# EAGLE schematic Spartan2Bone (EAGLE 8.0.1)
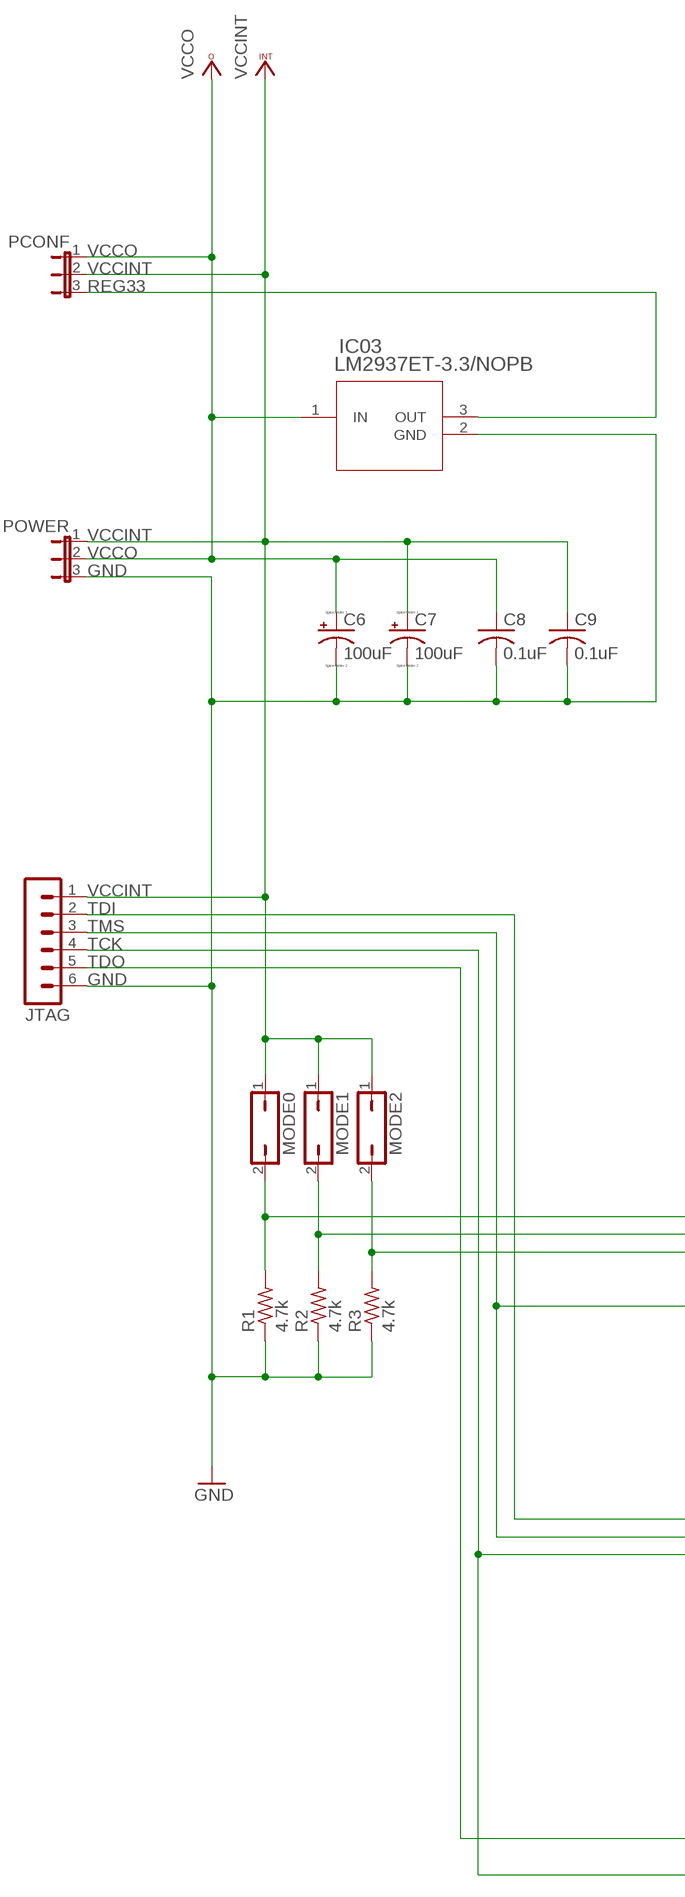
[diagram p0: schematic, sheet 1, part 1 of 2]
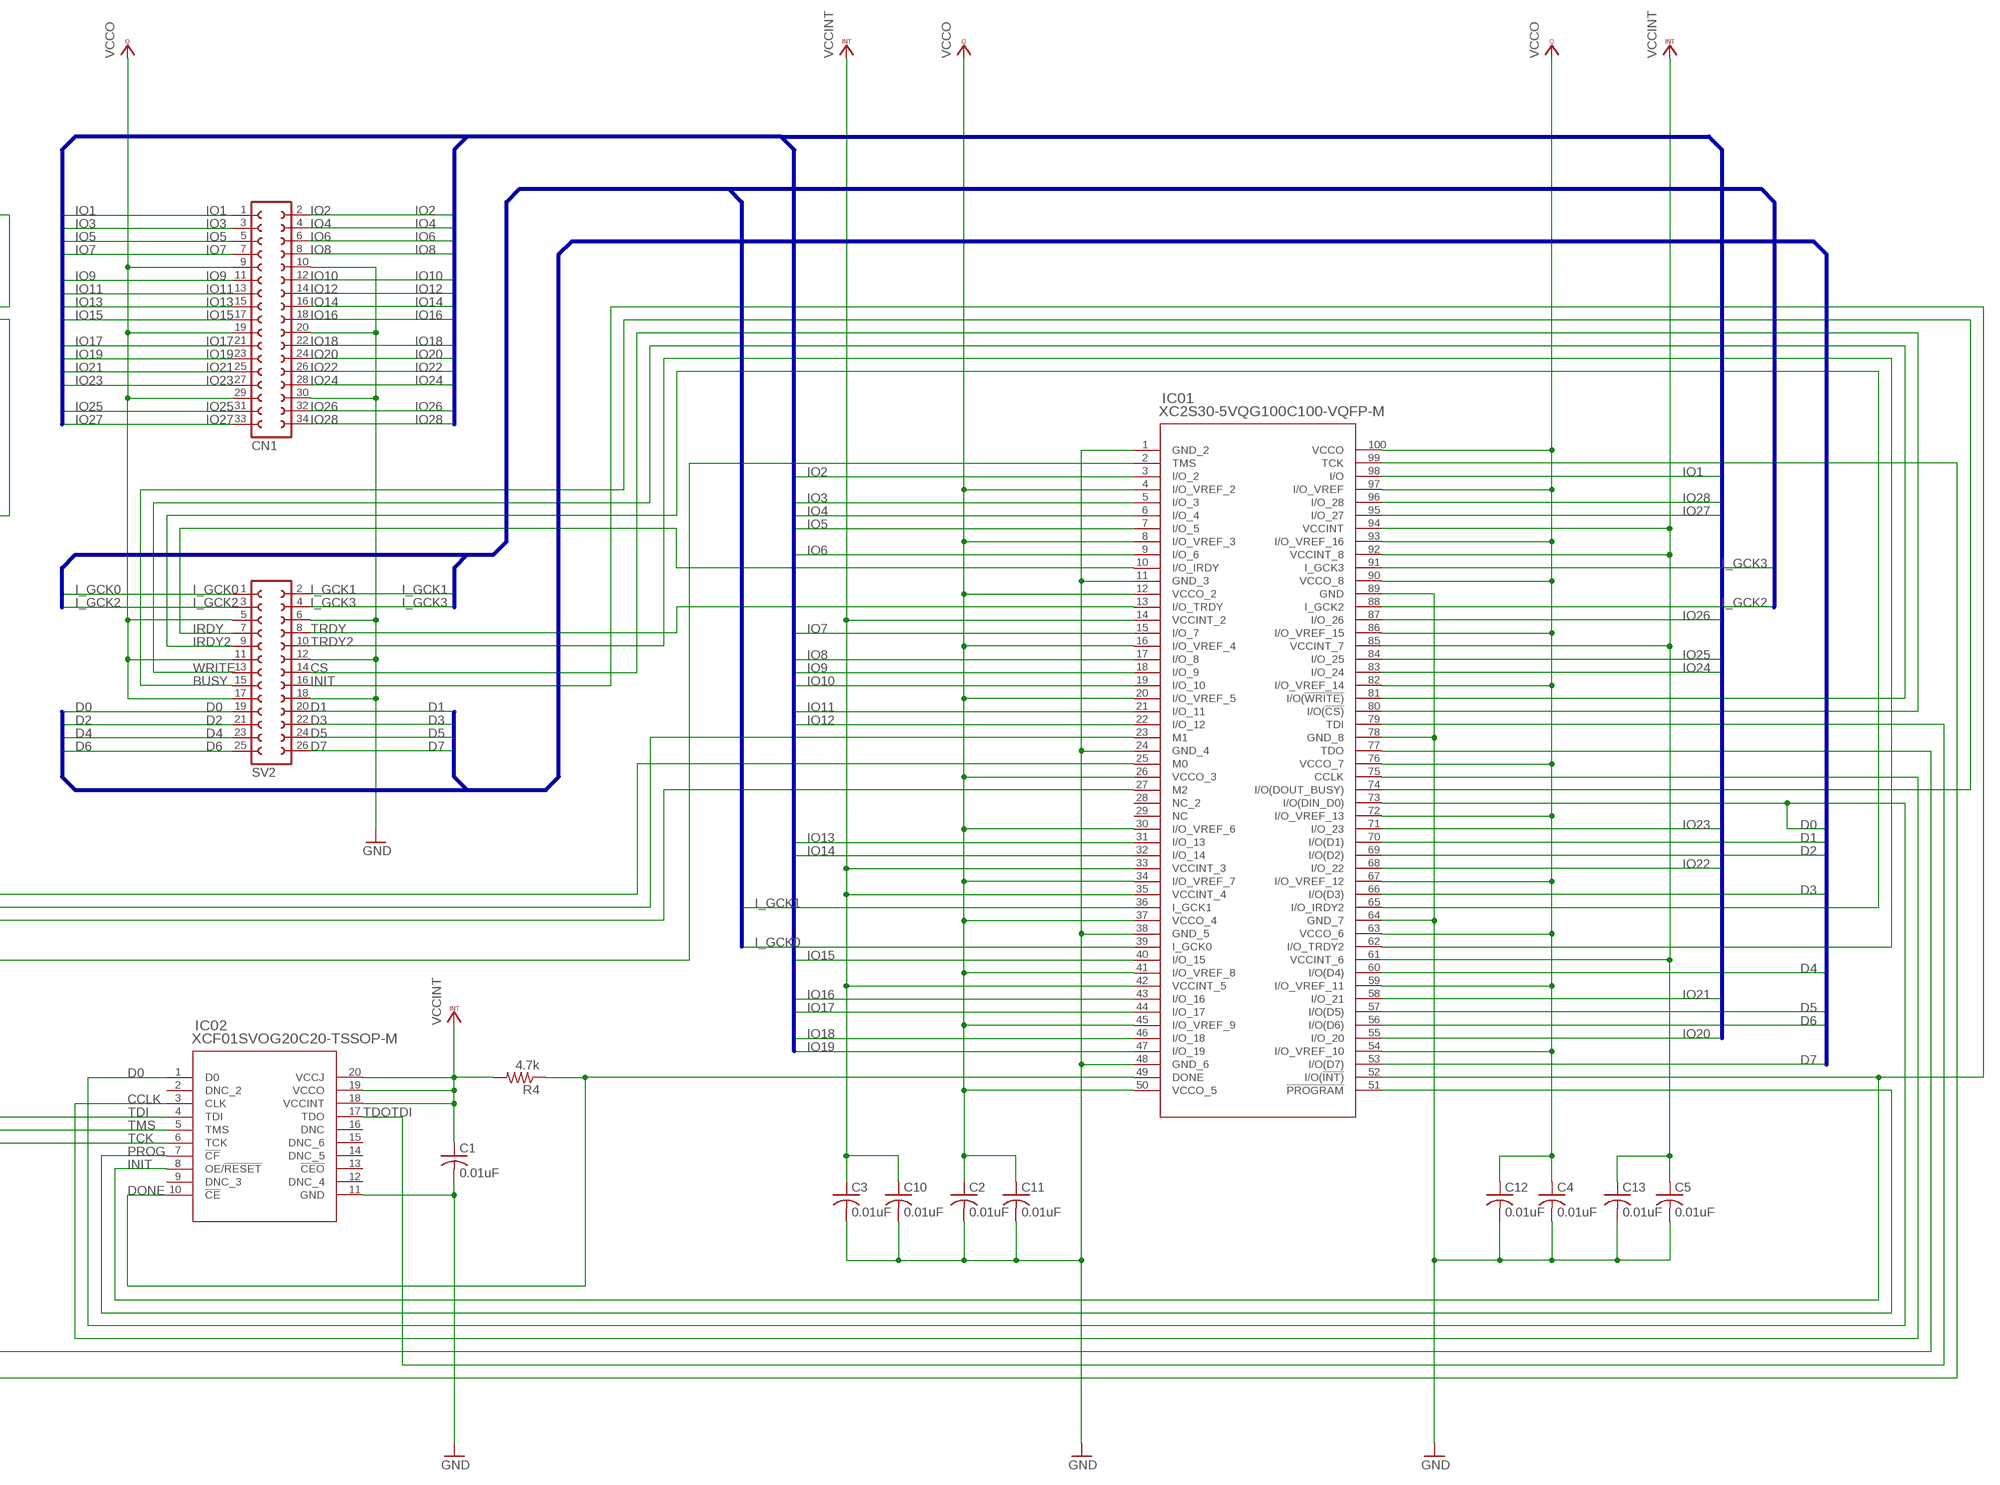
[diagram p1: schematic, sheet 1, part 2 of 2]

## Parts
C1  0.01uF  C-US050-024X044  [C050-024X044]
C2  0.01uF  C-US050-024X044  [C050-024X044]
C3  0.01uF  C-US050-024X044  [C050-024X044]
C4  0.01uF  C-US050-024X044  [C050-024X044]
C5  0.01uF  C-US050-024X044  [C050-024X044]
C6  100uF  CPOL-USE2.5-5  [E2,5-5]
C7  100uF  CPOL-USE2.5-5  [E2,5-5]
C8  0.1uF  C-US050-024X044  [C050-024X044]
C9  0.1uF  C-US050-024X044  [C050-024X044]
C10  0.01uF  C-US050-024X044  [C050-024X044]
C11  0.01uF  C-US050-024X044  [C050-024X044]
C12  0.01uF  C-US050-024X044  [C050-024X044]
C13  0.01uF  C-US050-024X044  [C050-024X044]
CN1  FE17-2  [FE17-2]
IC01  XC2S30-5VQG100C100-VQFP-M  [100-VQFP-M]
IC02  XCF01SVOG20C20-TSSOP-M  [20-TSSOP-M]
IC03  LM2937ET-3.3/NOPB  [T03B]
JTAG  MA06-1  [MA06-1]
MODE0  JP1Q  [JP1]
MODE1  JP1Q  [JP1]
MODE2  JP1Q  [JP1]
PCONF  JP2E  [JP2]
POWER  JP2E  [JP2]
R1  4.7k  R-US_0204/5  [0204/5]
R2  4.7k  R-US_0204/5  [0204/5]
R3  4.7k  R-US_0204/5  [0204/5]
R4  4.7k  R-US_0204/5  [0204/5]
SV2  FE13-2  [FE13-2]

## Nets
BUSY: IC01.74(I/O(DOUT_BUSY)) SV2.15
CCLK: IC01.75(CCLK) IC02.3(CLK)
CS: IC01.80(I/O(!CS)) SV2.14
D0: IC01.73(I/O(DIN_D0)) IC02.1(D0) SV2.19
D1: IC01.70(I/O(D1)) SV2.20
D2: IC01.69(I/O(D2)) SV2.21
D3: IC01.66(I/O(D3)) SV2.22
D4: IC01.60(I/O(D4)) SV2.23
D5: IC01.57(I/O(D5)) SV2.24
D6: IC01.56(I/O(D6)) SV2.25
D7: IC01.53(I/O(D7)) SV2.26
DONE: IC01.49(DONE) IC02.10(!CE) R4.1
GND: C1.2 C2.2 C3.2 C4.2 C5.2 C6.- C7.- C8.2 C9.2 C10.2 C11.2 C12.2 C13.2 CN1.10 CN1.20 CN1.30 IC01.1(GND_2) IC01.11(GND_3) IC01.24(GND_4) IC01.38(GND_5) IC01.48(GND_6) IC01.64(GND_7) IC01.78(GND_8) IC01.89(GND) IC02.11(GND) IC03.2(GND) JTAG.6 POWER.3 R1.1 R2.1 R3.1 SV2.6 SV2.12 SV2.18
I_GCK0: IC01.39(I_GCK0) SV2.1
I_GCK1: IC01.36(I_GCK1) SV2.2
I_GCK2: IC01.88(I_GCK2) SV2.3
I_GCK3: IC01.91(I_GCK3) SV2.4
INIT: IC01.52(I/O(!INT)) IC02.8(OE/!RESET) SV2.16
IO1: CN1.1 IC01.98(I/O)
IO2: CN1.2 IC01.3(I/O_2)
IO3: CN1.3 IC01.5(I/O_3)
IO4: CN1.4 IC01.6(I/O_4)
IO5: CN1.5 IC01.7(I/O_5)
IO6: CN1.6 IC01.9(I/O_6)
IO7: CN1.7 IC01.15(I/O_7)
IO8: CN1.8 IC01.17(I/O_8)
IO9: CN1.11 IC01.18(I/O_9)
IO10: CN1.12 IC01.19(I/O_10)
IO11: CN1.13 IC01.21(I/O_11)
IO12: CN1.14 IC01.22(I/O_12)
IO13: CN1.15 IC01.31(I/O_13)
IO14: CN1.16 IC01.32(I/O_14)
IO15: CN1.17 IC01.40(I/O_15)
IO16: CN1.18 IC01.43(I/O_16)
IO17: CN1.21 IC01.44(I/O_17)
IO18: CN1.22 IC01.46(I/O_18)
IO19: CN1.23 IC01.47(I/O_19)
IO20: CN1.24 IC01.55(I/O_20)
IO21: CN1.25 IC01.58(I/O_21)
IO22: CN1.26 IC01.68(I/O_22)
IO23: CN1.27 IC01.71(I/O_23)
IO24: CN1.28 IC01.83(I/O_24)
IO25: CN1.31 IC01.84(I/O_25)
IO26: CN1.32 IC01.87(I/O_26)
IO27: CN1.33 IC01.95(I/O_27)
IO28: CN1.34 IC01.96(I/O_28)
IRDY: IC01.10(I/O_IRDY) SV2.7
IRDY2: IC01.65(I/O_IRDY2) SV2.9
M0: IC01.25(M0) MODE0.2 R1.2
M1: IC01.23(M1) MODE1.2 R2.2
M2: IC01.27(M2) MODE2.2 R3.2
PROG: IC01.51(!PROGRAM) IC02.7(!CF)
REG33: IC03.3(OUT) PCONF.3
TCK: IC01.99(TCK) IC02.6(TCK) JTAG.4
TDI: IC02.4(TDI) JTAG.2
TDO: IC01.77(TDO) JTAG.5
TDOTDI: IC01.79(TDI) IC02.17(TDO)
TMS: IC01.2(TMS) IC02.5(TMS) JTAG.3
TRDY: IC01.13(I/O_TRDY) SV2.8
TRDY2: IC01.62(I/O_TRDY2) SV2.10
VCCINT: C1.1 C3.1 C5.1 C7.+ C9.1 C10.1 C13.1 IC01.14(VCCINT_2) IC01.33(VCCINT_3) IC01.35(VCCINT_4) IC01.42(VCCINT_5) IC01.61(VCCINT_6) IC01.85(VCCINT_7) IC01.92(VCCINT_8) IC01.94(VCCINT) IC02.18(VCCINT) IC02.19(VCCO) IC02.20(VCCJ) JTAG.1 MODE0.1 MODE1.1 MODE2.1 PCONF.2 POWER.1 R4.2
VCCO: C2.1 C4.1 C6.+ C8.1 C11.1 C12.1 CN1.9 CN1.19 CN1.29 IC01.4(I/O_VREF_2) IC01.8(I/O_VREF_3) IC01.12(VCCO_2) IC01.16(I/O_VREF_4) IC01.20(I/O_VREF_5) IC01.26(VCCO_3) IC01.30(I/O_VREF_6) IC01.34(I/O_VREF_7) IC01.37(VCCO_4) IC01.41(I/O_VREF_8) IC01.45(I/O_VREF_9) IC01.50(VCCO_5) IC01.54(I/O_VREF_10) IC01.59(I/O_VREF_11) IC01.63(VCCO_6) IC01.67(I/O_VREF_12) IC01.72(I/O_VREF_13) IC01.76(VCCO_7) IC01.82(I/O_VREF_14) IC01.86(I/O_VREF_15) IC01.90(VCCO_8) IC01.93(I/O_VREF_16) IC01.97(I/O_VREF) IC01.100(VCCO) IC03.1(IN) PCONF.1 POWER.2 SV2.5 SV2.11 SV2.17
WRITE: IC01.81(I/O(!WRITE)) SV2.13
Unconnected: IC01.28(NC_2) IC01.29(NC) IC02.2(DNC_2) IC02.9(DNC_3) IC02.12(DNC_4) IC02.13(!CEO) IC02.14(DNC_5) IC02.15(DNC_6) IC02.16(DNC)

## Buses
IO[1..28]
D[0..7]
I_GCK[0..3]

## Library data of the parts
C1-C5 C8-C13 = resistor:C-US: CAPACITOR, American symbol
C6 C7 = resistor:CPOL-US: POLARIZED CAPACITOR, American symbol
CN1 = con-lsta:FE17-2: FEMALE HEADER; OC_FARNELL: unknown; OC_NEWARK: unknown
IC01 = Spartan2Bone:XC2S30-5VQG100C; MANUFACTURER_PART_NUMBER: XC2S305VQG100C; VENDOR: Xilinx Inc
IC02 = Spartan2Bone:XCF01SVOG20C; MANUFACTURER_PART_NUMBER: XCF01SVOG20C; VENDOR: Xilinx Inc
IC03 = Spartan2Bone:LM2937ET-3.3/NOPB; MANUFACTURER_PART_NUMBER: lm2937et3_3nopb; VENDOR: National Semiconductor
JTAG = con-lstb:MA06-1: PIN HEADER; OC_FARNELL: unknown; OC_NEWARK: unknown
MODE0 MODE1 MODE2 = jumper:JP1Q: JUMPER
PCONF POWER = jumper:JP2E: JUMPER
R1-R4 = resistor:R-US_: RESISTOR, American symbol
SV2 = con-lsta:FE13-2: FEMALE HEADER; OC_FARNELL: unknown; OC_NEWARK: unknown